# Altium schematic sheet Hybrid control v2.SchDoc
size A4
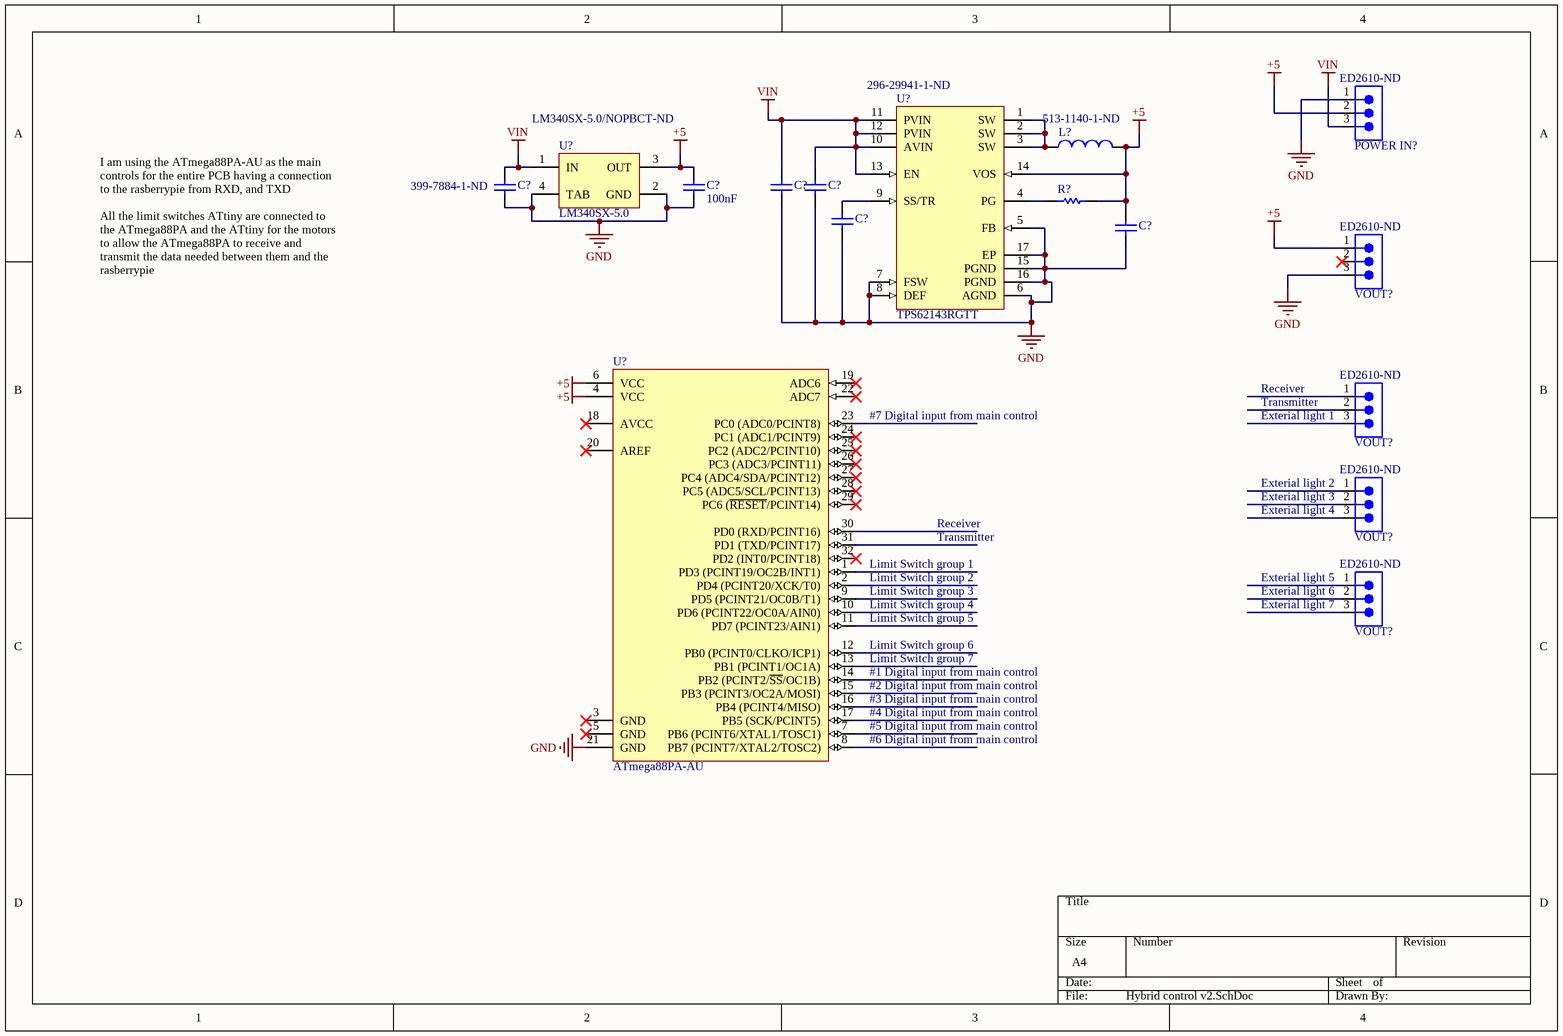
[diagram p0: Hybrid control v2.SchDoc]

## Parts
(Parts that share a designator on the sheet are numbered #1, #2 ... from top to bottom, then left to right.)
C?#1  C: 100nF  [CAPC1005X60X30ML05T10]  (hidden comment: C0402C104K8PAC7867)
C?#2  Supplier Part Number 1: 399-7884-1-ND  [CAPC1608X87X35ML15T15]  (hidden comment: C0603C224K3RACTU)
C?#3  GRM21BR61E106KA73L  [CAPC2013X135X45ML10T25]  (value not drawn)
C?#4  GCM188L81H104KA57D  [CAPC1608X90X35NL10T15]  (value not drawn)
C?#5  CAP 3.3nF 50V 0603(1608)  [CAPC0603(1608)100_N]  (value not drawn)
C?#6  GRM219R61A226MEA0D  [CAPC2013X95X45ML15T25]  (value not drawn)
L?  Supplier Part Number 2: 513-1140-1-ND  [COIL-IND-2_V]  (hidden comment: XFL4020-222MEC)
POWER_IN?  Supplier Part Number 2: ED2610-ND  [1x3 - OSTTC032162]  (hidden comment: 1x3 header 90120-0123)
R?  RC0603FR-07100KL  [RESC1608X55X25ML10T15]  (value not drawn)
U?#1  TPS62143RGTT  Supplier Part Number 1: 296-29941-1-ND  [RGT0016C_V]
U?#2  LM340SX-5.0  Supplier Part Number 1: LM340SX-5.0/NOPBCT-ND  [KTT0003B_M]
U?#3  ATmega88PA-AU  [32A_L]
VOUT?#1  Supplier Part Number 2: ED2610-ND  [1x3 - OSTTC032162]  (hidden comment: 1x3 header 90120-0123)
VOUT?#2  Supplier Part Number 2: ED2610-ND  [1x3 - OSTTC032162]  (hidden comment: 1x3 header 90120-0123)
VOUT?#3  Supplier Part Number 2: ED2610-ND  [1x3 - OSTTC032162]  (hidden comment: 1x3 header 90120-0123)
VOUT?#4  Supplier Part Number 2: ED2610-ND  [1x3 - OSTTC032162]  (hidden comment: 1x3 header 90120-0123)

## Nets
+5: C?#1.1 C?#6.2 L?.2 POWER_IN?.2 R?.2 U?#1.14(VOS) U?#2.3(OUT) U?#3.4(VCC) U?#3.6(VCC) VOUT?#1.1
GND: C?#1.2 C?#2.1 C?#3.1 C?#4.1 C?#5.1 C?#6.1 POWER_IN?.1 U?#1.5(FB) U?#1.6(AGND) U?#1.7(FSW) U?#1.8(DEF) U?#1.15(PGND) U?#1.16(PGND) U?#1.17(EP) U?#2.2(GND) U?#2.4(TAB) U?#3.21(GND) VOUT?#1.3
VIN: C?#2.2 C?#3.2 C?#4.2 POWER_IN?.3 U?#1.10(AVIN) U?#1.11(PVIN) U?#1.12(PVIN) U?#1.13(EN) U?#2.1(IN)
NetC?#5_2: C?#5.2 U?#1.9(SS/TR)
NetL?_1: L?.1 U?#1.1(SW) U?#1.2(SW) U?#1.3(SW)
NetR?_1: R?.1 U?#1.4(PG)

Not connected (* = marked no-connect by the designer): U?#3 1(PD3_(PCINT19/OC2B/INT1)) 2(PD4_(PCINT20/XCK/T0)) 3(GND)* 5(GND)* 7(PB6_(PCINT6/XTAL1/TOSC1)) 8(PB7_(PCINT7/XTAL2/TOSC2)) 9(PD5_(PCINT21/OC0B/T1)) 10(PD6_(PCINT22/OC0A/AIN0)) 11(PD7_(PCINT23/AIN1)) 12(PB0_(PCINT0/CLKO/ICP1)) 13(PB1_(PCINT1/OC1A)) 14(PB2_(PCINT2/~{SS}/OC1B)) 15(PB3_(PCINT3/OC2A/MOSI)) 16(PB4_(PCINT4/MISO)) 17(PB5_(SCK/PCINT5)) 18(AVCC)* 19(ADC6)* 20(AREF)* 22(ADC7)* 23(PC0_(ADC0/PCINT8)) 24(PC1_(ADC1/PCINT9))* 25(PC2_(ADC2/PCINT10))* 26(PC3_(ADC3/PCINT11))* 27(PC4_(ADC4/SDA/PCINT12))* 28(PC5_(ADC5/SCL/PCINT13))* 29(PC6_(~{RESET}/PCINT14))* 30(PD0_(RXD/PCINT16)) 31(PD1_(TXD/PCINT17)) 32(PD2_(INT0/PCINT18))*; VOUT?#1 2*; VOUT?#2 1 2 3; VOUT?#3 1 2 3; VOUT?#4 1 2 3

## Notes on the sheet
- I am using the ATmega88PA-AU as the main controls for the entire PCB having a connection to the rasberrypie from RXD, and TXD
  All the limit switches ATtiny are connected to the ATmega88PA and the ATtiny for the motors to allow the ATmega88PA to receive and transmit the data needed between them and the rasberrypie
- (near U?#3) #7 Digital input from main control
- (near VOUT?#2) Receiver
- (near VOUT?#2) Transmitter
- (near VOUT?#2) Exterial light 1
- (near VOUT?#3) Exterial light 2
- (near VOUT?#3) Exterial light 3
- (near VOUT?#3) Exterial light 4
- (near U?#3) Limit Switch group 1
- (near U?#3) Limit Switch group 2
- Receiver
- Transmitter
- (near VOUT?#4) Exterial light 5
- (near U?#3) Limit Switch group 3
- (near U?#3) Limit Switch group 4
- (near U?#3) Limit Switch group 5
- (near U?#3) Limit Switch group 6
- (near VOUT?#4) Exterial light 6
- (near VOUT?#4) Exterial light 7
- (near U?#3) Limit Switch group 7
- (near U?#3) #1 Digital input from main control
- (near U?#3) #2 Digital input from main control
- (near U?#3) #3 Digital input from main control
- (near U?#3) #4 Digital input from main control
- (near U?#3) #5 Digital input from main control
- (near U?#3) #6 Digital input from main control

## Library data of the parts
C?#1 = CMP-2008-02063-1: Manufacturer: Kemet; Part Number: C0402C104K8PAC7867
C?#2 = CMP-2006-03146-1: Manufacturer: Kemet; Dielectric Material: Ceramic; Capacitance: 220nF; Tolerance: 10%; Dielectric: X7R; Voltage Rating (DC): 25V; Dissipation Factor: 3.5%; Part Number: C0603C224K3RACTU; Supplier 1: Digi-Key; Manufacturer 1: KEMET; Manufacturer Part Number 1: C0603C224K3RACTU; Stock 1: 149863; Pricing 1: 1=0.21000, 10=0.14600, 100=0.06880, 500=0.04824, 1000=0.03994 (USD); RoHS: Yes; Mount: Surface Mount; Case/Package: 0603; Number of Pins: 2; Case Code (Imperial): 0603; Case Code (Metric): 1608; Min Operating Temperature: -55°C; Max Operating Temperature: 125°C; Packaging: Tape and Reel; Voltage: 25V; Package Quantity: 1; Voltage Rating: 25V; Termination: SMD/SMT; Length: 1.6mm; Height: 0.8mm; Depth: 0.8mm; Width: 0.8mm; Thickness: 0.034inch; Radiation Hardening: No; REACH SVHC: No SVHC; ComponentLink1URL: https://datasheet.ciiva.com/26894/getdatasheetpartid-410210-26894037.pdf?src-supplier=Verical; ComponentLink1Description: https://datasheet.ciiva.com/26894/getdatasheetpartid-410210-26894037.pdf?src-supplier=Verical
C?#3 = CMP-2007-03541-1: Manufacturer: Murata; Material: Ceramic; Capacitance: 10uF; Tolerance: 10%; Voltage Rating: 25V; Dielectric: X5R; Part Number: GRM21BR61E106KA73L; Supplier 1: Digi-Key; Supplier Part Number 1: 490-5523-1-ND; Manufacturer 1: Murata; Manufacturer Part Number 1: GRM21BR61E106KA73L; Stock 1: 14786936; Pricing 1: 1=0.42000, 10=0.29200, 100=0.17550, 500=0.13160, 1000=0.11113 (USD); RoHS: Yes; Mount: Surface Mount; Case/Package: 0805; Case Code (Metric): 2012; Case Code (Imperial): 0805; Min Operating Temperature: -55°C; Max Operating Temperature: 85°C; Packaging: Tape and Reel; Termination: SMD/SMT; Package Quantity: 1; Voltage Rating (DC): 25V; Voltage: 25V; Length: 2mm; Height: 1.25mm; Depth: 1.25mm; Width: 0.049inch; Thickness: 0.053inch; Radiation Hardening: No; REACH SVHC: Unknown; Lead Free: Lead Free; ComponentLink1URL: https://datasheet.ciiva.com/28584/626718-28584288.pdf?src-supplier=Element14; ComponentLink1Description: https://datasheet.ciiva.com/28584/626718-28584288.pdf?src-supplier=Element14; ComponentLink2URL: https://datasheet.ciiva.com/16440/grm21br61e106ka73l-16440627.pdf?src-supplier=Future+Electronics; ComponentLink2Description: https://datasheet.ciiva.com/16440/grm21br61e106ka73l-16440627.pdf?src-supplier=Future+Electronics; ComponentLink3URL: https://datasheet.ciiva.com/5424/product-5424327.pdf?src-supplier=Mouser; ComponentLink3Description: https://datasheet.ciiva.com/5424/product-5424327.pdf?src-supplier=Mouser; ComponentLink4URL: https://datasheet.ciiva.com/22774/1747469-22774396.pdf?src-supplier=Farnell; ComponentLink4Description: https://datasheet.ciiva.com/22774/1747469-22774396.pdf?src-supplier=Farnell; ComponentLink5URL: https://datasheet.ciiva.com/29199/454623-da-01-en-vs-kondensator-0805-29199615.pdf?src-supplier=Conrad; ComponentLink5Description: https://datasheet.ciiva.com/29199/454623-da-01-en-vs-kondensator-0805-29199615.pdf?src-supplier=Conrad; ComponentLink6URL: https://datasheet.ciiva.com/139/partnumbering-e-01-139184.pdf?src-supplier=Digi-Key; ComponentLink6Description: https://datasheet.ciiva.com/139/partnumbering-e-01-139184.pdf?src-supplier=Digi-Key; ComponentLink7URL: https://datasheet.ciiva.com/7719/1747469-7719093.pdf?src-supplier=Element14; ComponentLink7Description: https://datasheet.ciiva.com/7719/1747469-7719093.pdf?src-supplier=Element14; ComponentLink8URL: https://datasheet.ciiva.com/28584/626718-28584279.pdf?src-supplier=Element14; ComponentLink8Description: https://datasheet.ciiva.com/28584/626718-28584279.pdf?src-supplier=Element14; ComponentLink9URL: https://datasheet.ciiva.com/14116/grmseries-highdielectrictype-eng-14116376.pdf?src-supplier=Distrelec; ComponentLink9Description: https://datasheet.ciiva.com/14116/grmseries-highdielectrictype-eng-14116376.pdf?src-supplier=Distrelec; ComponentLink10URL: https://datasheet.ciiva.com/139/partnumbering-e-01-139182.pdf?src-supplier=Digi-Key; ComponentLink10Description: https://datasheet.ciiva.com/139/partnumbering-e-01-139182.pdf?src-supplier=Digi-Key; ComponentLink11URL: https://datasheet.ciiva.com/139/partnumbering-e-01-139183.pdf?src-supplier=Digi-Key; ComponentLink11Description: https://datasheet.ciiva.com/139/partnumbering-e-01-139183.pdf?src-supplier=Digi-Key
C?#4 = CMP-2006-02353-1: Manufacturer: Murata; Capacitance: 100nF; Tolerance: 10%; Voltage Rating: 50V; Dielectric: X8L; Part Number: GCM188L81H104KA57D; Supplier 1: Digi-Key; Supplier Part Number 1: 490-6049-1-ND; Manufacturer 1: Murata; Manufacturer Part Number 1: GCM188L81H104KA57D; Stock 1: 6300183; Pricing 1: 1=0.18000, 10=0.13000, 100=0.06100, 500=0.04280, 1000=0.03543 (USD); RoHS: Yes; Mount: Surface Mount; Case/Package: 0603; Case Code (Metric): 1608; Case Code (Imperial): 0603; Min Operating Temperature: -55°C; Max Operating Temperature: 150°C; Packaging: Tape and Reel; Package Quantity: 4000; Termination: SMD/SMT; Voltage Rating (DC): 50V; Voltage: 50V; Length: 1.6mm; Height: 0.8mm; Width: 0.5mm; Thickness: 0.035inch; Depth: 0.8mm; Ratings: AEC-Q200; Radiation Hardening: No; Lead Free: Lead Free; ComponentLink1URL: https://datasheet.ciiva.com/6277/s0717e-6277799.pdf?src-supplier=Digi-Key; ComponentLink1Description: https://datasheet.ciiva.com/6277/s0717e-6277799.pdf?src-supplier=Digi-Key; ComponentLink2URL: https://datasheet.ciiva.com/6277/s0717e-6277800.pdf?src-supplier=Digi-Key; ComponentLink2Description: https://datasheet.ciiva.com/6277/s0717e-6277800.pdf?src-supplier=Digi-Key; ComponentLink3URL: https://datasheet.ciiva.com/6277/s0717e-6277801.pdf?src-supplier=Digi-Key; ComponentLink3Description: https://datasheet.ciiva.com/6277/s0717e-6277801.pdf?src-supplier=Digi-Key
C?#5 = CMP-1035-02124-1: CAP 3.3nF 50V ±10% 0603 (1608 Metric) Thickness 1mm SMD; Manufacturer 1: Kyocera AVX; Manufacturer Part Number 1: 06035C332KAT2A; Case-Metric: 1608; Tolerance: Â±10%; Case-EIA: 0603; Dielectric Material: Ceramic; Dielectric: X7R; Technology: SMT; Max Thickness: 1 mm; Value: 3.3nF; Rated Voltage: 50 V; Supplier 1: Digi-Key; Supplier Part Number 1: 478-1221-1-ND; Stock 1: 747056; Pricing 1: 1=0.10000, 10=0.05100, 100=0.02250, 500=0.01610, 1000=0.01265 (USD); RoHS: Yes; Mount: Surface Mount; Case/Package: 0603; Number of Pins: 2; Weight: 7.1E-05oz; Case Code (Metric): 1608; Case Code (Imperial): 0603; Contact Plating: Tin,Matte; Min Operating Temperature: -55°C; Max Operating Temperature: 125°C; Capacitance: 3.3nF; Voltage Rating: 50V; Packaging: Tape and Reel; Voltage Rating (DC): 50V; Termination: SMD/SMT; Package Quantity: 1; Voltage: 50V; Length: 1.6mm; Height: 0.9mm; Width: 0.032inch; Depth: 0.81mm; Thickness: 0.035inch; Radiation Hardening: No; REACH SVHC: Unknown; Lead Free: Lead Free; ComponentLink1URL: https://datasheet.ciiva.com/11787/0900766b802d4698-11787185.pdf?src-supplier=RSComponents; ComponentLink1Description: https://datasheet.ciiva.com/11787/0900766b802d4698-11787185.pdf?src-supplier=RSComponents; ComponentLink2URL: https://datasheet.ciiva.com/150/cx7r-150336.pdf?src-supplier=Digi-Key; ComponentLink2Description: https://datasheet.ciiva.com/150/cx7r-150336.pdf?src-supplier=Digi-Key; ComponentLink3URL: https://datasheet.ciiva.com/150/cx7r-150337.pdf?src-supplier=Digi-Key; ComponentLink3Description: https://datasheet.ciiva.com/150/cx7r-150337.pdf?src-supplier=Digi-Key; ComponentLink4URL: https://datasheet.ciiva.com/1457/1679506-1457939.pdf?src-supplier=Element14; ComponentLink4Description: https://datasheet.ciiva.com/1457/1679506-1457939.pdf?src-supplier=Element14; ComponentLink5URL: https://datasheet.ciiva.com/1457/1679506-1457940.pdf?src-supplier=Element14; ComponentLink5Description: https://datasheet.ciiva.com/1457/1679506-1457940.pdf?src-supplier=Element14; ComponentLink6URL: https://datasheet.ciiva.com/11464/cx7r-11464565.pdf?src-supplier=Avnet; ComponentLink6Description: https://datasheet.ciiva.com/11464/cx7r-11464565.pdf?src-supplier=Avnet; ComponentLink7URL: https://datasheet.ciiva.com/16537/cx7r-16537989.pdf?src-supplier=Avnet+Asia; ComponentLink7Description: https://datasheet.ciiva.com/16537/cx7r-16537989.pdf?src-supplier=Avnet+Asia; ComponentLink8URL: https://datasheet.ciiva.com/2987/cx7r-2987847.pdf?src-supplier=Avnet; ComponentLink8Description: https://datasheet.ciiva.com/2987/cx7r-2987847.pdf?src-supplier=Avnet; ComponentLink9URL: https://datasheet.ciiva.com/16327/cx7r-16327047.pdf?src-supplier=Future+Electronics; ComponentLink9Description: https://datasheet.ciiva.com/16327/cx7r-16327047.pdf?src-supplier=Future+Electronics; ComponentLink10URL: https://datasheet.ciiva.com/150/cx7r-150335.pdf?src-supplier=Digi-Key; ComponentLink10Description: https://datasheet.ciiva.com/150/cx7r-150335.pdf?src-supplier=Digi-Key
C?#6 = CMP-2007-00096-1: Manufacturer: Murata; Dielectric Material: Ceramic; Tolerance: 20%; Capacitance: 22uF; Voltage Rating: 10V; Dielectric: X5R; Dissipation Factor: 0.035%; Part Number: GRM219R61A226MEA0D; Supplier 1: Digi-Key; Supplier Part Number 1: 490-9951-1-ND; Manufacturer 1: Murata; Manufacturer Part Number 1: GRM219R61A226MEA0D; Stock 1: 262948; Pricing 1: 1=0.43000, 10=0.30100, 100=0.18070, 500=0.13554, 1000=0.11446 (USD); RoHS: Yes; Mount: Surface Mount; Case/Package: 0805; Case Code (Metric): 2012; Case Code (Imperial): 0805; Min Operating Temperature: -55°C; Max Operating Temperature: 85°C; Packaging: Cut Tape; Termination: SMD/SMT; Voltage Rating (DC): 10V; Voltage: 10V; Length: 0.079inch; Height: 0.85mm; Width: 0.049inch; Depth: 1.25mm; Thickness: 0.037inch; REACH SVHC: No SVHC; ComponentLink1URL: http://www.farnell.com/datasheets/2079175.pdf?src-supplier=Farnell; ComponentLink1Description: http://www.farnell.com/datasheets/2079175.pdf?src-supplier=Farnell; ComponentLink2URL: http://search.murata.co.jp/Ceramy/image/img/A01X/G101/ENG/GRM219R61A226MEA0-01.pdf?src-supplier=Avnet+Europe; ComponentLink2Description: http://search.murata.co.jp/Ceramy/image/img/A01X/G101/ENG/GRM219R61A226MEA0-01.pdf?src-supplier=Avnet+Europe; ComponentLink3URL: http://www.farnell.com/datasheets/2079175.pdf?src-supplier=Newark; ComponentLink3Description: http://www.farnell.com/datasheets/2079175.pdf?src-supplier=Newark; ComponentLink4URL: http://search.murata.co.jp/Ceramy/image/img/A01X/G101/ENG/GRM219R61A226MEA0-01.pdf?src-supplier=Mouser; ComponentLink4Description: http://search.murata.co.jp/Ceramy/image/img/A01X/G101/ENG/GRM219R61A226MEA0-01.pdf?src-supplier=Mouser; ComponentLink5URL: http://search.murata.co.jp/Ceramy/image/img/A01X/G101/ENG/GRM219R61A226MEA0-01.pdf?src-supplier=Avnet; ComponentLink5Description: http://search.murata.co.jp/Ceramy/image/img/A01X/G101/ENG/GRM219R61A226MEA0-01.pdf?src-supplier=Avnet; ComponentLink6URL: http://search.murata.co.jp/Ceramy/image/img/A01X/G101/ENG/GRM219R61A226MEA0-01.pdf?src-supplier=Digi-Key; ComponentLink6Description: http://search.murata.co.jp/Ceramy/image/img/A01X/G101/ENG/GRM219R61A226MEA0-01.pdf?src-supplier=Digi-Key; ComponentLink7URL: http://www.farnell.com/datasheets/2079175.pdf?src-supplier=Element14; ComponentLink7Description: http://www.farnell.com/datasheets/2079175.pdf?src-supplier=Element14; ComponentLink8URL: http://search.murata.co.jp/Ceramy/image/img/A01X/G101/ENG/GRM219R61A226MEA0-01.pdf?src-supplier=RSComponents; ComponentLink8Description: http://search.murata.co.jp/Ceramy/image/img/A01X/G101/ENG/GRM219R61A226MEA0-01.pdf?src-supplier=RSComponents; ComponentLink9URL: http://search.murata.co.jp/Ceramy/image/img/A01X/G101/ENG/GRM219R61A226MEA0-01.pdf?src-supplier=Area51; ComponentLink9Description: http://search.murata.co.jp/Ceramy/image/img/A01X/G101/ENG/GRM219R61A226MEA0-01.pdf?src-supplier=Area51; ComponentLink10URL: http://search.murata.co.jp/Ceramy/image/img/A01X/G101/ENG/GRM219R61A226MEA0-01.pdf?src-supplier=Quest; ComponentLink10Description: http://search.murata.co.jp/Ceramy/image/img/A01X/G101/ENG/GRM219R61A226MEA0-01.pdf?src-supplier=Quest; ComponentLink11URL: http://search.murata.co.jp/Ceramy/image/img/A01X/G101/ENG/GRM219R61A226MEA0-01.pdf?src-supplier=TTI; ComponentLink11Description: http://search.murata.co.jp/Ceramy/image/img/A01X/G101/ENG/GRM219R61A226MEA0-01.pdf?src-supplier=TTI
L? = CMP-2000-05090-2: High Temperature Shielded Power Inductor, 2.2 uH, +/- 20 %, -40 to 125 degC, 2-Pin SMD, RoHS, Tape and Reel; Manufacturer: Coilcraft; Case Length: 4.3mm; Case Height: 2.1mm; Tolerance: 20%; Self Resonant Frequency: 38MHz; Inductance: 2.2uH; Maximum DC Resistance: 23.5mOhms; Test Frequency: 100kHz; Core Material: Composite; Maximum DC Current: 8A; DC Resistance (DCR): 23.5mR; Saturation Current: 3.1A; Current Rating: 4.76A; Series Resistance: 12.6mR; Case Width: 4.3mm; Series: XFL4020; RoHS: Details; Termination Style: SMD/SMT; PartNumber: XFL4020-222MEC; Datasheet Version: Jul-12; Shielding: Shielded; Datasheet URL: http://www.mouser.com/ds/2/597/xfl4020-270756.pdf; Dimensions: 4.3mmWx4.3mmLx2.1mmH; Operating Temperature Range: -40Cto+125C; Packaging: Reel; Product: PowerInductors; Manufacturer URL: http://www.coilcraft.com/; Supplier 1: Mouser; Supplier Part Number 1: 994-XFL4020-222MEC; Manufacturer 1: Coilcraft; Manufacturer Part Number 1: XFL4020-222MEC; Stock 1: 20262; Pricing 1: 1=2.13000, 10=2.13000, 50=1.85000, 100=1.55000, 200=1.55000, 500=0.96000, 1000=0.88400, 2000=0.82300 (USD); Mount: Surface Mount; Case/Package: SMD/SMT; Min Operating Temperature: -40°C; Max Operating Temperature: 125°C; Max DC Current: 8A; Termination: SMD/SMT; Inductance Tolerance: 20%; RMS Current (Irms): 8A; Length: 4.3mm; Height: 2.1mm; Width: 4.3mm; Lead Free: Contains Lead; REACH SVHC: No SVHC; ComponentLink1URL: https://datasheet.ciiva.com/22679/1682010-22679277.pdf?src-supplier=Element14; ComponentLink1Description: https://datasheet.ciiva.com/22679/1682010-22679277.pdf?src-supplier=Element14; ComponentLink2URL: https://datasheet.ciiva.com/22679/1682010-22679278.pdf?src-supplier=Element14; ComponentLink2Description: https://datasheet.ciiva.com/22679/1682010-22679278.pdf?src-supplier=Element14; Supplier 2: Digi-Key; Manufacturer 2: Eaton Cooper; Manufacturer Part Number 2: DR74-2R2-R; Stock 2: 1684; Pricing 2: 1=1.91000, 10=1.76600, 100=1.23650, 500=1.00096 (USD); Number of Pins: 2; Weight: 0.048oz; Package Quantity: 1100; Composition: Wirewound; Military Standard: Not; Height - Seated (Max): 0.171inch; Depth: 7.6mm; Radiation Hardening: No; ComponentLink3URL: https://datasheet.ciiva.com/14667/0900766b8116a153-14667792.pdf?src-supplier=RSComponents; ComponentLink3Description: https://datasheet.ciiva.com/14667/0900766b8116a153-14667792.pdf?src-supplier=RSComponents; ComponentLink4URL: https://datasheet.ciiva.com/30213/43bus-elx-ds-4315-dr-ser-30213367.pdf?src-supplier=Onlinecomponents.com; ComponentLink4Description: https://datasheet.ciiva.com/30213/43bus-elx-ds-4315-dr-ser-30213367.pdf?src-supplier=Onlinecomponents.com; ComponentLink5URL: https://datasheet.ciiva.com/14123/dr-series-eng-tds-14123512.pdf?src-supplier=Distrelec; ComponentLink5Description: https://datasheet.ciiva.com/14123/dr-series-eng-tds-14123512.pdf?src-supplier=Distrelec; ComponentLink6URL: https://datasheet.ciiva.com/8005/87246-8005229.pdf?src-supplier=Element14; ComponentLink6Description: https://datasheet.ciiva.com/8005/87246-8005229.pdf?src-supplier=Element14
POWER_IN? VOUT?#1-VOUT?#4 = 1x3 header 90120-0123: HDR 1x3, 2.54mm Pitch, Vert TH; Manufacturer: Molex; Plating: Steel; Max Current Rating: 15A; Number of Levels: 1; Number of Positions Per Level: 3; Voltage: 300V; Wire Gauge (Max): 22AWG; Wire Gauge (Min): 14AWG; Pitch: 0.2inch; Manufacturer Part #: 90120-0123; Supplier Part Number 1: WM8073-ND; Cost: 0.57; Supplier 1: Digi-Key; RoHS: Y; Supplier 2: Digi-Key; Manufacturer 2: On-Shore Technology; Manufacturer Part Number 2: OSTTC032162; Stock 2: 6880; Pricing 2: 1=0.85000, 10=0.53000, 25=0.45400, 50=0.40800, 100=0.39950, 250=0.34000, 500=0.32300, 1000=0.28900, 5000=0.22610 (USD); Mount: Through Hole; Color: Blue; Contact Plating: Tin; Housing Color: Blue; Contact Material: Brass; Housing Material: Thermoplastic; Min Operating Temperature: -30°C; Max Operating Temperature: 105°C; Packaging: Bulk; Number of Rows: 1; Current: 15A; Termination: Screw; Number of Contacts: 3; Number of Positions: 3; Length: 15.2mm; Height: 10mm; Width: 7.6mm; Lead Free: Lead Free; Flammability Rating: UL94 V-0; ComponentLink1URL: https://datasheet.ciiva.com/823/osttcxx2162-823568.pdf?src-supplier=Digi-Key; ComponentLink1Description: https://datasheet.ciiva.com/823/osttcxx2162-823568.pdf?src-supplier=Digi-Key; ComponentLink2URL: https://datasheet.ciiva.com/19458/2120655-19458972.pdf?src-supplier=Jameco; ComponentLink2Description: https://datasheet.ciiva.com/19458/2120655-19458972.pdf?src-supplier=Jameco
R? = CMP-2100-03662-1: Chip Resistor, 100 KOhm, +/- 1%, 0.1 W, -55 to 155 degC, 0603 (1608 Metric), RoHS, Tape and Reel; Manufacturer: Yageo; Power Rating: 100mW; Voltage Rating: 50V; Temperature Coefficient: 100ppm/degreesC; Working Voltage: 75V; Datasheet Version: Rev. 5, 10/2016; Height: 0.45mm; Lead Free: LeadFree; Manufacturer URL: http://www.yageo.com/; Package Reference: 0603; Depth: 0.8mm; RoHSCompliant: true; Composition: ThickFilm; Military Standard: Not; Resistance: 100KOhm; Case/Package: 0603; Packaging: TapeandReel; Case Code (Imperial): 0603; Voltage Rating (DC): 50V; Case Code (Metric): 1608; Tolerance: 1%; Termination: SMD/SMT; Min Operating Temperature: -55degC; Number of Pins: 2; Length: 1.6mm; Width: 0.8mm; Datasheet URL: http://www.yageo.com/NewPortal/yageodocoutput?fileName=/pdf/R-Chip/PYu-RC_Group_51_RoHS_L_5.pdf; Package Description: 2-Pin Surface Mount Device, Body 1.6 x 0.8 mm; Max Operating Temperature: 155degC; REACH SVHC: NoSVHC; Supplier 1: Digi-Key; Supplier Part Number 1: 311-100KHRCT-ND; Manufacturer 1: Yageo; Manufacturer Part Number 1: RC0603FR-07100KL; Stock 1: 44261318; Pricing 1: 1=0.10000, 10=0.02300, 100=0.00940, 1000=0.00421, 2500=0.00366 (USD); RoHS: Yes; Number of Terminations: 2; ComponentLink1URL: https://datasheet.ciiva.com/11808/0900766b80f96399-11808107.pdf?src-supplier=RSComponents; ComponentLink1Description: https://datasheet.ciiva.com/11808/0900766b80f96399-11808107.pdf?src-supplier=RSComponents; ComponentLink2URL: https://datasheet.ciiva.com/7983/443971-7983593.pdf?src-supplier=Element14; ComponentLink2Description: https://datasheet.ciiva.com/7983/443971-7983593.pdf?src-supplier=Element14; ComponentLink3URL: https://datasheet.ciiva.com/46440/1868787-46440889.pdf?src-supplier=Element14; ComponentLink3Description: https://datasheet.ciiva.com/46440/1868787-46440889.pdf?src-supplier=Element14; ComponentLink4URL: https://datasheet.ciiva.com/7746/1738695-7746234.pdf?src-supplier=Element14; ComponentLink4Description: https://datasheet.ciiva.com/7746/1738695-7746234.pdf?src-supplier=Element14; ComponentLink5URL: https://datasheet.ciiva.com/7746/1738695-7746235.pdf?src-supplier=Element14; ComponentLink5Description: https://datasheet.ciiva.com/7746/1738695-7746235.pdf?src-supplier=Element14; ComponentLink6URL: https://datasheet.ciiva.com/22747/443971-22747516.pdf?src-supplier=Element14; ComponentLink6Description: https://datasheet.ciiva.com/22747/443971-22747516.pdf?src-supplier=Element14
U?#1 = CMP-0323-00125-3: Buck Step Down Regulator with 3 to 17 V Input and 5 V Output, -40 to 85 degC, 16-Pin QFN (RGT), Green (RoHS & no Sb/Br); Manufacturer: Texas Instruments; Vin(Max)(V): 17; Synchronous Rectification: TRUE; Vout(Min)(V): 5; Vin(Min)(V): 3; Duty Cycle(Max)(%): 100; Iout(Max)(A): 2; Regulated Outputs(#): 1; Iq(Typ)(mA): 0.017; Rating: Catalog; SubFamily: Step-Down Regulator; Switching Frequency: 2.5MHz; Output Voltage: 5V; Output Current: 2A; Max Input Voltage: 17V; Min Input Voltage: 3V; Synchronous Rectifier: Yes; Quiescent Current: 17uA; Output Type: Fixed; Output Configuration: Positive; ComponentLink2Description: Package Specification; PackageVersion: revH, Oct-2011; ComponentLink1Description: Datasheet; ComponentLink3Description: URL Link1; Code_JEDEC: MO-220; Mounting Technology: Surface Mount; PartNumber: TPS62143RGTT; Vout(Max)(V): 5; Topology: Buck; ComponentLink1URL: http://www.ti.com/general/docs/lit/getliterature.tsp?genericPartNumber=TPS62143&fileType=pdf; Eco-Plan: Green (RoHS & no Sb/Br); Preset Vout(V): 5; PackageReference: RGT0016C; Switch Current Limit(Typ)(A): 3; ComponentLink2URL: http://www.ti.com/litv/pdf/mpqf119g; DatasheetVersion: SLVSAJ0; ComponentLink3URL: Samples URL:http://www.ti.com/product/tps54611#samples; PackageDescription: 16-Pin Plastic Quad Flat No-Lead, 3 x 3 mm Body, 0.5 mm Pitch, 1.7 x 1.7 mm Exposed Pad; Supplier 1: Digi-Key; Manufacturer 1: Texas Instruments; Manufacturer Part Number 1: TPS62143RGTT; Stock 1: 80284; Pricing 1: 1=2.40000, 10=2.15400, 100=1.62530 (USD); RoHS: Yes; Case/Package: QFN; Number of Pins: 16; Min Operating Temperature: -40°C; Max Operating Temperature: 125°C; Packaging: Tape and Reel; Package Quantity: 250; Nominal Output Voltage: 5V; Number of Outputs: 1; Max Output Current: 2A; Min Output Voltage: 5V; Max Output Voltage: 5V; Operating Supply Voltage: 17V; Length: 3.15mm; Height: 0.95mm; Width: 3.15mm; Radiation Hardening: No; REACH SVHC: No SVHC; Lead Free: Lead Free; ComponentLink4URL: https://datasheet.ciiva.com/2026/tps62141-2026276.pdf?src-supplier=Digi-Key; ComponentLink4Description: https://datasheet.ciiva.com/2026/tps62141-2026276.pdf?src-supplier=Digi-Key; ComponentLink5URL: https://datasheet.ciiva.com/28671/1781879-28671384.pdf?src-supplier=Element14; ComponentLink5Description: https://datasheet.ciiva.com/28671/1781879-28671384.pdf?src-supplier=Element14; ComponentLink6URL: https://datasheet.ciiva.com/26100/tps62140-26100664.pdf?src-supplier=Avnet+Europe; ComponentLink6Description: https://datasheet.ciiva.com/26100/tps62140-26100664.pdf?src-supplier=Avnet+Europe; ComponentLink7URL: https://datasheet.ciiva.com/2026/tps62140-2026283.pdf?src-supplier=Digi-Key; ComponentLink7Description: https://datasheet.ciiva.com/2026/tps62140-2026283.pdf?src-supplier=Digi-Key; ComponentLink8URL: https://datasheet.ciiva.com/2026/tps62140-2026284.pdf?src-supplier=Digi-Key; ComponentLink8Description: https://datasheet.ciiva.com/2026/tps62140-2026284.pdf?src-supplier=Digi-Key
U?#2 = CMP-0062-00625-4: Series 3-Terminal Positive Regulators, 3-pin TO-263; Manufacturer: Texas Instruments; Manufacturer Part Number 1: LM340SX-5.0/NOPB; PowerWise: N; PackageTopMarking: NSUZXYTTE#*LM340S*-5.0 P+; CompType: LDO IC; Min Input Voltage: 7.5V; Max Input Voltage: 35V; Output Voltage: 5V; Max Output Current: 1A; Number of Outputs: 1; Dropout Voltage: 2V; Quiescent Current: 8mA; Accuracy: 2%; Power Supply Rejection Ratio (PSRR): 80dB; Output Type: Fixed; ComponentLink1URL: http://www.ti.com/general/docs/lit/getliterature.tsp?genericPartNumber=LM340-N&fileType=pdf; PinCount: 3; PackageDescription: TO-263, Molded, .400 x .390 x .180in, 3 Lead, .1in Pitch, Surface Mount; Code_JEDEC: MO-169-AA; RoHS: N; ComponentLink1Description: Datasheet URL; PackageReference: KTT0003B; Supplier 1: Digi-Key; Manufacturer 1: Texas Instruments; Stock 1: 27504; Pricing 1: 1=1.54000, 10=1.38100, 100=1.04200 (USD); Mount: Surface Mount; Case/Package: TO-263; Number of Pins: 3; Min Operating Temperature: 0°C; Max Operating Temperature: 125°C; Package Quantity: 500; Packaging: Tape and Reel; Output Current: 1A; Nominal Output Voltage: 5V; Polarity: Positive; Output Voltage Accuracy: 2%; Max Output Voltage: 5V; Length: 10.16mm; Height: 4.57mm; Width: 8.64mm; REACH SVHC: No SVHC; Lead Free: Contains Lead; ComponentLink2URL: https://datasheet.ciiva.com/46381/1882927-46381862.pdf?src-supplier=Element14; ComponentLink2Description: https://datasheet.ciiva.com/46381/1882927-46381862.pdf?src-supplier=Element14; ComponentLink3URL: https://datasheet.ciiva.com/46381/1888853-46381897.pdf?src-supplier=Element14; ComponentLink3Description: https://datasheet.ciiva.com/46381/1888853-46381897.pdf?src-supplier=Element14; ComponentLink4URL: https://datasheet.ciiva.com/49028/1888853-49028029.pdf?src-supplier=Element14; ComponentLink4Description: https://datasheet.ciiva.com/49028/1888853-49028029.pdf?src-supplier=Element14
U?#3 = CMP-0095-00213-2: 8-bit AVR Microcontroller, 8KB Flash, 512 Bytes EEPROM, 1KB SRAM, 32-pin TQFP, Industrial Grade (-40°C to 85°C); PackageReference: 32A; PackageDescription: 32-Lead, 7x7x1.0 mm Body, 0.8mm Lead Pitch, Thin Profile Plastic Quad Flat Package (TQFP); ComponentLink2Description: ATmega48A/48PA/88A/88PA/168A/168PA/328/328P Datasheet; ComponentLink3URL: http://www.atmel.com/dyn/resources/prod_documents/8271S.pdf; ComponentLink3Description: ATmega48A/48PA/88A/88PA/168A/168PA/328/328P Summary; PackageVersion: revC, Oct-2010; RevisionNote: DatasheetVersion & PackageVersion updated. URLs added.; DatasheetVersion: revD, May-2011; ComponentLink1URL: http://www.atmel.com/; ComponentLink2URL: http://www.atmel.com/dyn/resources/prod_documents/doc8271.pdf; Code_JEDEC: MS-026-ABA; ComponentLink1Description: Manufacturer URL